# Altium project BATTERY-CHARGER-NOV2021.PrjPcb
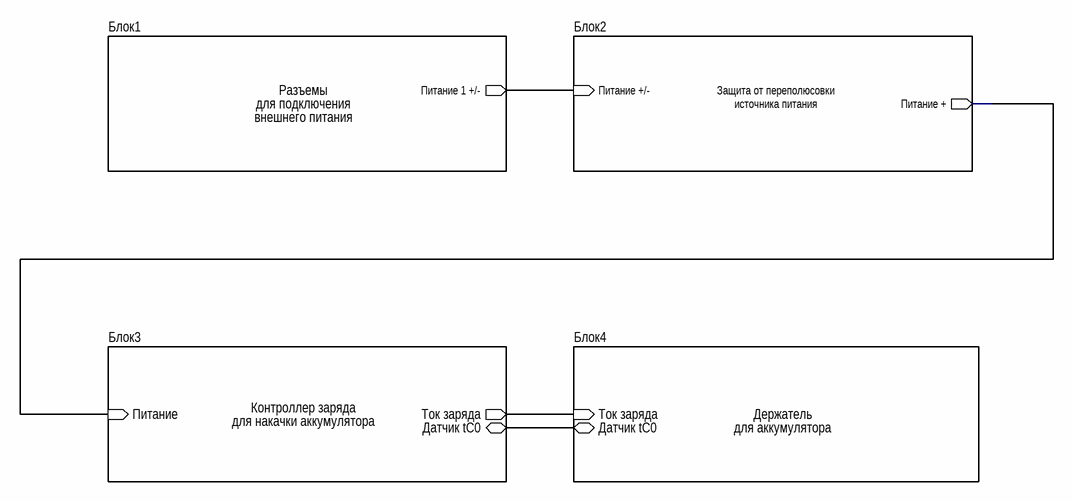
[diagram p0: Структура.SchDoc]
5 sheets, 27 parts. Net scope: flat (ports and power ports of the same name join across sheets).
Board file: PCB1.PcbDoc
Sheets:
  Структура.SchDoc
    Блок1 = Блок1.SchDoc
    Блок3 = Блок3.SchDoc
    Блок4 = Блок4.SchDoc
    Блок2 = Блок2.SchDoc

## Sheet Структура.SchDoc
size A4; SheetNumber: 1; SheetTotal: 3

### Sub-sheets
Блок1 = Блок1.SchDoc: Питание 1 +/- (out)  | Parameter 1: Разъемы; Parameter 2: для подключения; Parameter 3: внешнего питания
Блок2 = Блок2.SchDoc: Питание + (out), Питание +/- (in)  | Parameter 1: источника питания; Parameter 3: Защита от переполюсовки
Блок3 = Блок3.SchDoc: Питание (in), Ток заряда (out), Датчик tC0 (bidir)  | Parameter 1: Контроллер заряда; Parameter 2: для накачки аккумулятора; Parameter 3: для накачки аккумулятора
Блок4 = Блок4.SchDoc: Ток заряда (in), Датчик tC0 (bidir)  | Parameter 1: Держатель; Parameter 2: для аккумулятора; Parameter 3: -

### Nets
(unnamed): sheet Блок1/Питание 1 +/-, sheet Блок2/Питание +/-
(unnamed): sheet Блок3/Питание, sheet Блок2/Питание +
(unnamed): sheet Блок3/Ток заряда, sheet Блок4/Ток заряда
(unnamed): sheet Блок3/Датчик tC0, sheet Блок4/Датчик tC0

## Sheet Блок1.SchDoc
size A4; SheetNumber: 2; SheetTotal: 2
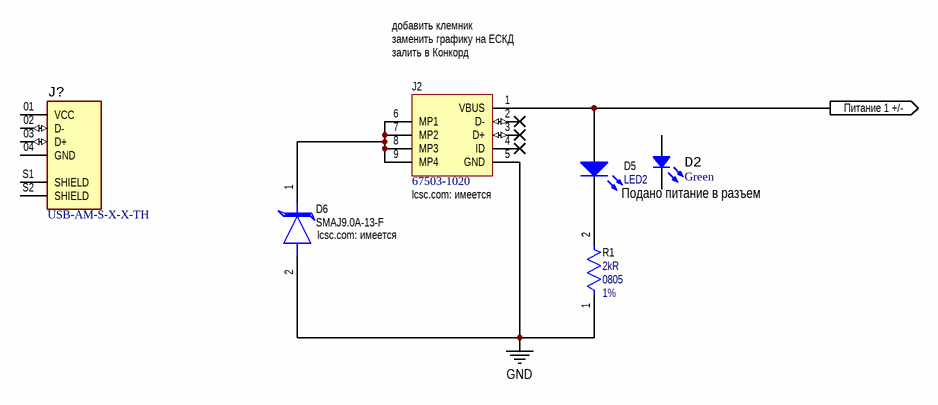
[diagram p1: Блок1.SchDoc]

### Parts
D2  Green  [LED 1206_3216 GREEN]
D5  LED2  Parameter 1: Подано питание в разъем  [3.2X1.6X1.1]
D6  SMAJ9.0A-13-F  lcsc.com: имеется  [FP-SMA-MFG]
J2  67503-1020  lcsc.com: имеется  [MOLX-67503-1020_V]
J?  USB-AM-S-X-X-TH  [SAMTEC_USB-AM-S-X-X-TH]
R1  Resistance: 2kR  Case/Package: 0805  Tolerance: 1%  [FP-MC01W0805-IPC_C]  (hidden comment: MC01W0805110K)

### Ports
Питание 1 +/- (out)

### Nets
GND: D6.2(A) J2.5(GND) R1.1
NetD5_1: D5.1(A) J2.1(VBUS) ; port Питание 1 +/-
NetD5_2: D5.2(K) R1.2
NetD6_1: D6.1(C) J2.6(MP1) J2.7(MP2) J2.8(MP3) J2.9(MP4)

Not connected (* = marked no-connect by the designer): D2 1 2; J2 2(D-)* 3(D+)* 4(ID)*; J? 01(VCC) 02(D-) 03(D+) 04(GND) S1(SHIELD) S2(SHIELD)

### Notes on the sheet
- добавить клемник
- заменить графику на ЕСКД
- (near J2) залить в Конкорд

### Library data of the parts
D2 = SML-LX1206SUGC-TR: LED GREEN CLEAR 1206 SMD; Manufacturer: Lumex Opto/Components Inc.; Configuration: Standard; Current - Test: 20mA; Lens Color: Colorless; Lens Size: 2.00mm x 1.50mm; Lens Style: Rectangle with Flat Top; Millicandela Rating: 45mcd; Viewing Angle: 140°; Voltage - Forward (Vf) (Typ): 2.2V; Wavelength - Peak: 574nm; Part Number: SML-LX1206SUGC-TR; Color: Green; ComponentLink1Description: Datasheet; ComponentLink1URL: https://www.lumex.com/content/files/ProductAttachment/SML-LX1206SUGC-TR.pdf; ComponentLink2Description: DigiKey Link; ComponentLink2URL: http://digikey.com/product-detail/en/lumex-opto-components-inc/SML-LX1206SUGC-TR/67-1698-1-ND/467582; Device Package: 1206 (3216 Metric); Height (Max): 1.10mm; LastUpdated: 02.09.2020 1:20:47; Lens Transparency: Clear; Lifecycle Status: Active; Minimum Order: 1; Mounting Type: Surface Mount; Package / Case: 1206 (3216 Metric); Packaging: TapeAndReel; PartId: 530; Part Status: Active; Price: 0.09; Series: -; Size / Dimension: 3.20mm L x 1.60mm W; Supplier 1: DigiKey; Supplier Part Number 1: 67-1698-1-ND; Supplier Device Package: 1206; Value: Green
D5 = LED2: Typical RED, GREEN, YELLOW, AMBER GaAs LED; Published: 8-Jun-2000; LatestRevisionDate: 17-Jul-2002; LatestRevisionNote: Re-released for DXP Platform.; PackageVersion: Feb-2002; PackageReference: 3.2X1.6X1.1; Publisher: Altium Limited; PackageDescription: SM LED; 2 Flat Leads
D6 = CMP-12828-000014-1: TVS DIODE 9V 15.4V SMA; Manufacturer: Diodes Inc; Number Of Channels: 1; Standoff Height: 0.05mm; Max Junction Temp: +150°C; Direction: Unidirectional; Breakdown Voltage: 10V; Peak Pulse Current: 26A; Peak Pulse Power: 400W; Category: Diode; Footprint Url: https://www.diodes.com/assets/Package-Files/SMA.pdf; Lead Free: Yes; Mouser Description: TVS Diodes - Transient Voltage Suppressors 400W 9.0V; Automotive: No; Temperature Range Low: -55°C; Temperature Range High: +150°C; Manufacturer Part Number: SMAJ9.0A-13-F; RoHS: TRUE; Octopart: https://octopart.com/smaj9.0a-13-f-diodes+inc.-350369; Device Class L3: unset; Device Class L2: TVS Diodes; Clamping Voltage: 15.4V; Temperature: -55°C to +150°C; ComponentLink2Description: Datasheet; Package: SMA; Reverse Standoff Voltage: 9V; Digikey Description: TVS DIODE 9V 15.4V SMA; Height: 2.4mm; ComponentLink2URL: https://www.diodes.com/assets/Datasheets/ds19005.pdf; Device Class L1: Circuit Protection; lcsc.com link: https://lcsc.com/product-detail/TVS_Diodes-Incorporated-SMAJ9-0CA-13-F_C135023.html
J2 = CMP-0411-00002-1: USB, MINI, SMD, RA KME04-USBMU03A01; Manufacturer: Molex; ComponentLink1URL: http://www.molex.com/; PartNumber: 67503-1020; Mounting Technology: Surface Mount; ComponentLink1Description: Manufacturer URL; Terminal Pitch: 0.8 mm; DatasheetVersion: Rev F, 06/2009; ComponentLink2Description: Datasheet; PackageDescription: Mini USB Connector, SMT, Righer Angle; ComponentLink2URL: http://www.molex.com/pdm_docs/sd/675031020_sd.pdf; PackageReference: 67503-1020; lcsc.com/product: https://lcsc.com/product-detail/USB-Connectors_MOLEX-675031020_C136451.html
J? = CMP-003-000000-2: USB-A (USB TYPE-A) USB 2.0 Plug Connector 4 Position Through Hole, Right Angle; MF: Samtec; MP: USB-AM-S-F-B-TH; SnapEDA_Link: https://www.snapeda.com/parts/USB-AM-S-F-B-TH/Samtec%20Inc./view-part/474273/?ref=snap; Price: None; Toby_UK-Purchase-URL: https://snapeda.com/shop?store=Toby+UK&id=474273; Value: *; Package: None; Component Type: Standard; Pin Count: 6; Availability: Unavailable; Design Item ID: USB-AM-S-X-X-TH; Source: SnapEDAsch.SchLib
R1 = CMP-12256-000003-1: Resistor, 10K, 0.1W, 1%, 0805, Reel; Manufacturer: Multicomp; Voltage Rating: 150V; Temperature Coefficient: 100ppm/°C; Power Rating: 100mW; REACH SVHC: No SVHC; Composition: Thick Film; Max Operating Temperature: 155°C; Number of Pins: 2; Case Code (Metric): 2012; Voltage Rating (DC): 150V; Min Operating Temperature: -55°C; Width: 1.25mm; Case Code (Imperial): 0805; Packaging: Cut Tape; Supplier 1: Newark; Supplier Part Number 1: 07W5303; Manufacturer Part Number: MC01W0805110K; RoHS: No; Category: Chip SMD Resistors; Stock 1: 940000; Pricing 1: 1=0,00900, 5000=0,00900, 10000=0,00800, 25000=0,00600 (USD); Series: MC; Resistor Type: Thick Film; Resistance Tolerance: 1%; RoHS Compliant: No; ComponentLink1URL: https://datasheet.ciiva.com/7881/1729047-7881334.pdf?src-supplier=Element14; ComponentLink1Description: https://datasheet.ciiva.com/7881/1729047-7881334.pdf?src-supplier=Element14; ComponentLink2URL: https://datasheet.ciiva.com/7881/1729047-7881333.pdf?src-supplier=Element14; ComponentLink2Description: https://datasheet.ciiva.com/7881/1729047-7881333.pdf?src-supplier=Element14

## Sheet Блок3.SchDoc
size A4
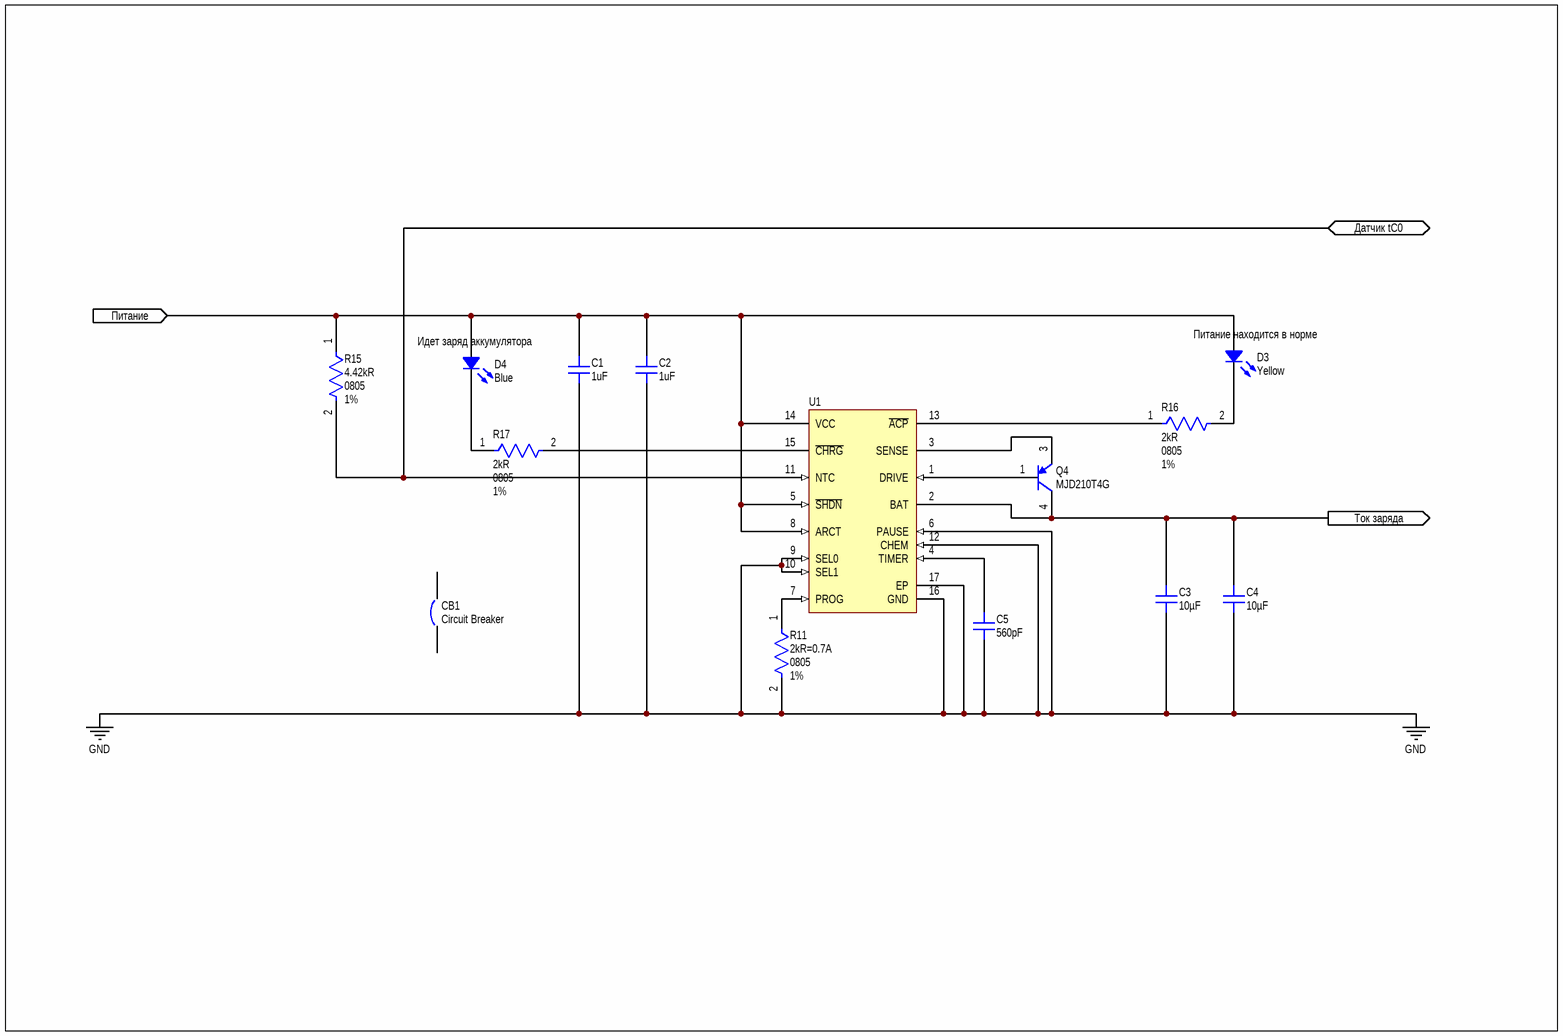
[diagram p2: Блок3.SchDoc]

### Parts
C1  1uF  [CAP 1206_3216 - 1.2MM]
C2  1uF  [CAP 1206_3216 - 1.2MM]
C3  10µF  [CAP 1206_3216 - 1.0MM]
C4  10µF  [CAP 1206_3216 - 1.0MM]
C5  560pF  [CAP 1206_3216 - 0.8MM]
CB1  Circuit Breaker  [SPST-2]
D3  Yellow  Parameter 1: Питание находится в норме  [LED 1206_3216 YELLOW]
D4  Blue  Parameter 1: Идет заряд аккумулятора  [LED 1206_3216 BLUE]
Q4  MJD210T4G  [ONSC-DPAK-3-369C-01_V]
R11  Resistance: 2kR=0.7A  Case/Package: 0805  Tolerance: 1%  [FP-MC01W0805-IPC_C]  (hidden comment: MC01W0805110K)
R15  Resistance: 4.42kR  Case/Package: 0805  Tolerance: 1%  [FP-MC01W0805-IPC_C]  (hidden comment: MC01W0805110K)
R16  Resistance: 2kR  Case/Package: 0805  Tolerance: 1%  [FP-MC01W0805-IPC_C]  (hidden comment: MC01W0805110K)
R17  Resistance: 2kR  Case/Package: 0805  Tolerance: 1%  [FP-MC01W0805-IPC_C]  (hidden comment: MC01W0805110K)
U1  LTC4060EDHC#PBF  [LT-DHC-16_V]  (value not drawn)

### Ports
Датчик tC0 (bidir), Питание (in), Ток заряда (out)

### Nets
GND: C1.1 C2.1 C3.1 C4.1 C5.1 R11.2 U1.6(PAUSE) U1.9(SEL0) U1.10(SEL1) U1.12(CHEM) U1.16(GND) U1.17(EP)
NetBH1_1: C3.2 C4.2 Q4.4(C) U1.2(BAT) ; port Ток заряда
NetC1_2: C1.2 C2.2 D3.1 D4.1 R15.1 U1.5(~{SHDN}) U1.8(ARCT) U1.14(VCC) ; port Питание
NetC5_2: C5.2 U1.4(TIMER)
NetD3_2: D3.2 R16.2
NetD4_2: D4.2 R17.1
NetQ4_1: Q4.1(B) U1.1(DRIVE)
NetQ4_3: Q4.3(E) U1.3(SENSE)
NetR11_1: R11.1 U1.7(PROG)
NetR15_2: R15.2 U1.11(NTC) ; port Датчик tC0
NetR16_1: R16.1 U1.13(~{ACP})
NetR17_2: R17.2 U1.15(~{CHRG})

Not connected (* = marked no-connect by the designer): CB1 1 2

### Library data of the parts
C1 C2 = C1206C105M5RACTU: CAP CER 1UF 50V X7R 1206; Manufacturer: KEMET; Capacitance: 1µF; Tolerance: ±20%; Part Number: C1206C105M5RACTU; Value: 1uF; Applications: Bypass, Decoupling; ComponentLink1Description: Datasheet; ComponentLink1URL: https://api.kemet.com/component-edge/download/datasheet/C1206C105M5RACTU.pdf; ComponentLink2Description: DigiKey Link; ComponentLink2URL: http://digikey.com/product-detail/en/kemet/C1206C105M5RACTU/399-8151-1-ND/3471874; Device Package: 1206 (3216 Metric); LastUpdated: 02.09.2020 1:05:10; Lifecycle Status: Active; Minimum Order: 1; Mounting Type: Surface Mount, MLCC; Operating Temperature: -55°C ~ 125°C; Package / Case: 1206 (3216 Metric); Packaging: TapeAndReel; PartId: 18886; Part Status: Active; Price: 0.07; Series: SMD Comm X7R; Size / Dimension: 0.126" L x 0.063" W (3.20mm x 1.60mm); Supplier 1: DigiKey; Supplier Part Number 1: 399-8151-1-ND; Temperature Coefficient: X7R; Thickness (Max): 0.043" (1.10mm); Voltage - Rated: 50V
C3 C4 = EMK316BJ106MD-T: CAP CER 10UF 16V X5R 1206; Manufacturer: Taiyo Yuden; Tolerance: ±20%; Part Number: EMK316BJ106MD-T; Value: 10µF; Applications: General Purpose; Capacitance: 10µF; ComponentLink1Description: Datasheet; ComponentLink1URL: http://www.yuden.co.jp/productdata/catalog/mlcc06_e.pdf; ComponentLink2Description: DigiKey Link; ComponentLink2URL: http://digikey.com/product-detail/en/taiyo-yuden/EMK316BJ106MD-T/587-4881-1-ND/6563724; Device Package: 1206 (3216 Metric); LastUpdated: 02.09.2020 1:05:06; Lifecycle Status: Active; Minimum Order: 1; Mounting Type: Surface Mount, MLCC; Operating Temperature: -55°C ~ 85°C; Package / Case: 1206 (3216 Metric); Packaging: TapeAndReel; PartId: 18996; Part Status: Active; Price: 0.05; Series: M; Size / Dimension: 0.126" L x 0.063" W (3.20mm x 1.60mm); Supplier 1: DigiKey; Supplier Part Number 1: 587-4881-1-ND; Temperature Coefficient: X5R; Thickness (Max): 0.037" (0.95mm); Voltage - Rated: 16V
C5 = CC1206JRNPO9BN561: CAP CER 560PF 50V NPO 1206; Manufacturer: Yageo; Temperature Coefficient: C0G, NP0; Tolerance: ±5%; Part Number: CC1206JRNPO9BN561; Value: 560pF; Applications: General Purpose; Capacitance: 560pF; ComponentLink1Description: Datasheet; ComponentLink1URL: https://www.yageo.com/upload/media/product/productsearch/datasheet/mlcc/UPY-GP_NP0_16V-to-50V_17.pdf; ComponentLink2Description: DigiKey Link; ComponentLink2URL: http://digikey.com/product-detail/en/yageo/CC1206JRNPO9BN561/311-4422-1-ND/8025511; Device Package: 1206 (3216 Metric); LastUpdated: 02.09.2020 1:04:45; Lifecycle Status: Active; Minimum Order: 1; Mounting Type: Surface Mount, MLCC; Operating Temperature: -55°C ~ 125°C; Package / Case: 1206 (3216 Metric); Packaging: TapeAndReel; PartId: 18850; Part Status: Active; Price: 0.05; Series: CC; Size / Dimension: 0.126" L x 0.063" W (3.20mm x 1.60mm); Supplier 1: DigiKey; Supplier Part Number 1: 311-4422-1-ND; Thickness (Max): 0.028" (0.70mm); Voltage - Rated: 50V
D3 = APTD3216SYCK: LED YELLOW CLEAR 2SMD; Manufacturer: Kingbright; Configuration: Standard; Current - Test: 20mA; Lens Color: Colorless; Lens Size: 1.60mm Dia; Lens Style: Round with Domed Top; Millicandela Rating: 800mcd; Viewing Angle: 35°; Voltage - Forward (Vf) (Typ): 2V; Wavelength - Dominant: 590nm; Part Number: APTD3216SYCK; Color: Yellow; ComponentLink1Description: Datasheet; ComponentLink1URL: http://www.kingbrightusa.com/images/catalog/SPEC/APTD3216SYCK.pdf; ComponentLink2Description: DigiKey Link; ComponentLink2URL: http://digikey.com/product-detail/en/kingbright/APTD3216SYCK/754-1160-1-ND/1747877; Device Package: 1206 (3216 Metric); Height (Max): 1.90mm; LastUpdated: 02.09.2020 1:21:25; Lens Transparency: Clear; Lifecycle Status: Active; Minimum Order: 1; Mounting Type: Surface Mount; Package / Case: 1206 (3216 Metric); Packaging: TapeAndReel; PartId: 38; Part Status: Active; Price: 0.10; Series: -; Size / Dimension: 3.20mm L x 1.60mm W; Supplier 1: DigiKey; Supplier Part Number 1: 754-1160-1-ND; Supplier Device Package: 2-SMD; Value: Yellow; Wavelength - Peak: 590nm
D4 = IN-S126ATB: LED BLUE CLEAR 1206 SMD; Manufacturer: Inolux; Configuration: Standard; Current - Test: 20mA; Lens Size: 2.00mm x 1.50mm; Lens Style: Rectangle with Flat Top; Millicandela Rating: 140mcd; Viewing Angle: 120°; Voltage - Forward (Vf) (Typ): 3.2V; Wavelength - Dominant: 468nm; Wavelength - Peak: 472nm; Part Number: IN-S126ATB; Color: Blue; ComponentLink1Description: Datasheet; ComponentLink1URL: http://www.inolux-corp.com/datasheet/SMDLED/Mono%20Color%20Top%20View/IN-S126AT%20Series_V1.0.pdf; ComponentLink2Description: DigiKey Link; ComponentLink2URL: http://digikey.com/product-detail/en/inolux/IN-S126ATB/1830-1088-1-ND/7604680; Device Package: 1206 (3216 Metric); Height (Max): 1.10mm; LastUpdated: 02.09.2020 1:20:34; Lens Color: Clear; Lens Transparency: Clear; Lifecycle Status: Active; Minimum Order: 1; Mounting Type: Surface Mount; Package / Case: 1206 (3216 Metric); Packaging: TapeAndReel; PartId: 723; Part Status: Active; Price: 0.07; Series: IN-S126AT; Size / Dimension: 3.20mm L x 1.50mm W; Supplier 1: DigiKey; Supplier Part Number 1: 1830-1088-1-ND; Supplier Device Package: 1206; Value: Blue
Q4 = CMP-1048-00154-1: Complementary Plastic Power Transistor, PNP Silicon, 3-Pin DPAK, Pb-Free, Tape and Reel; Manufacturer: On Semiconductor; fT Min (MHz): 65; IC Continuous (A): 5; ComponentLink1URL: http://www.onsemi.com/; Mounting Technology: Surface Mount; ComponentLink3Description: Package Specification; PackageReference: DPAK-3-369C-01; DatasheetVersion: Rev. 13; ComponentLink2URL: http://www.onsemi.cn/pub_link/Collateral/MJD200-D.PDF; ComponentLink3URL: http://www.onsemi.cn/pub_link/Collateral/369C.PDF; Packing: Tape and Reel; PackageDescription: 3-Pin Flange Mount, Body 6.54 x 6.095 mm, Pitch 2.29 mm; PartNumber: MJD210T4G; Polarity: PNP; RoHS: TRUE; PackageVersion: Rev. E, 02/2014; ComponentLink2Description: Datasheet; ComponentLink1Description: Manufacturer URL
R11 R15-R17 = CMP-12256-000003-1: as R1 on sheet Блок1; REACH SVHC: No SVHC; Composition: Thick Film; Max Operating Temperature: 155°C; Number of Pins: 2; Case Code (Metric): 2012; Voltage Rating (DC): 150V; Min Operating Temperature: -55°C; Width: 1.25mm; Case Code (Imperial): 0805; Packaging: Cut Tape; Supplier 1: Newark; Supplier Part Number 1: 07W5303; Manufacturer Part Number: MC01W0805110K; RoHS: No; Category: Chip SMD Resistors; Stock 1: 940000; Pricing 1: 1=0,00900, 5000=0,00900, 10000=0,00800, 25000=0,00600 (USD); Series: MC; Resistor Type: Thick Film; Resistance Tolerance: 1%; RoHS Compliant: No; ComponentLink1URL: https://datasheet.ciiva.com/7881/1729047-7881334.pdf?src-supplier=Element14; ComponentLink1Description: https://datasheet.ciiva.com/7881/1729047-7881334.pdf?src-supplier=Element14; ComponentLink2URL: https://datasheet.ciiva.com/7881/1729047-7881333.pdf?src-supplier=Element14; ComponentLink2Description: https://datasheet.ciiva.com/7881/1729047-7881333.pdf?src-supplier=Element14
U1 = CMP-0471-00160-1: Standalone Linear NiMH / NiCd Fast Battery Charger, 4.5 to 10 V Vin, 16-pin SON (DHC-16), -40 to 85 degC, Pb-Free; Manufacturer: Linear Technology; Float Voltage: Adj; Vin Min(V): 4.5; Max Charge Current(A): 2; Battery Chemistry: NiCd, NiMH, Lead Acid; Number of Cells: 1 to 4; Vin Max(V): 10; PartNumber: LTC4060EDHC#PBF; PackageVersion: Jun-10; ComponentLink1URL: http://www.linear.com/; ComponentLink3Description: Package Specification; RoHS: TRUE; PackageReference: DHC-16; ComponentLink2Description: Datasheet; Mounting Technology: Surface Mount; PackageDescription: 16-Pin Plastic DFN, Body 5 x 3 mm, Pitch 0.5 mm; ComponentLink1Description: Manufacturer URL; Type of Charger: Linear; ComponentLink2URL: http://cds.linear.com/docs/en/datasheet/4060f.pdf; ComponentLink3URL: http://cds.linear.com/docs/en/packaging/DFN_16_05-08-1706.pdf; Code_JEDEC: MO-229
CB1 = Circuit Breaker: Published: 24-Mar-1999; LatestRevisionDate: 17-Jul-2002; LatestRevisionNote: Re-released for DXP Platform.; PackageReference: SPST-2; Publisher: Altium Limited; PackageDescription: Switch; 2 Leads

## Sheet Блок4.SchDoc
size A4
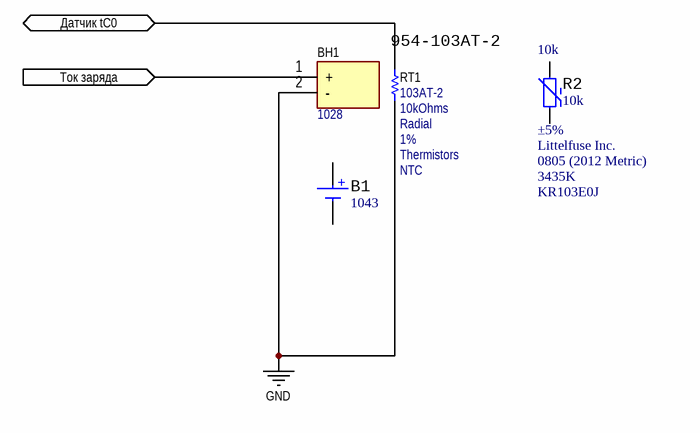
[diagram p3: Блок4.SchDoc]

### Parts
B1  1043  [KEYSTONE 1043]
BH1  1028  [1028]
R2  10k  Part Number: KR103E0J  B25/85: 3435K  Manufacturer: Littelfuse Inc.  Package / Case: 0805 (2012 Metric)  Resistance Tolerance: ±5%  [NTC 0805_2012]
RT1  103AT-2  Resistance: 10kOhms  Termination Style: Radial  Tolerance: 1%  Product Category: Thermistors  Type: NTC  Supplier Part Number 1: 954-103AT-2  [SEMI-103AT-2_V]

### Ports
Датчик tC0 (bidir), Ток заряда (in)

### Nets
GND: BH1.2(-) RT1.1
NetBH1_1: BH1.1(+) ; port Ток заряда
NetR15_2: RT1.2 ; port Датчик tC0

Not connected (* = marked no-connect by the designer): B1 1(+) 2(-); R2 1 2

### Library data of the parts
B1 = 1043: BATTERY HOLDER 18650 PC PIN; Manufacturer: Keystone Electronics; Battery Cell Size: 18650; Battery Type, Function: Cylindrical, Holder; Number of Cells: 1; Style: Holder (Open); Part Number: 1043; ComponentLink1Description: Datasheet; ComponentLink1URL: http://keyelco.com/userAssets/file/M65p27.pdf; ComponentLink2Description: DigiKey Link; ComponentLink2URL: http://digikey.com/product-detail/en/keystone-electronics/1043/36-1043-ND/2745669; Height Above Board: 0.585" (14.86mm); LastUpdated: 02.02.2020 9:19:56; Lifecycle Status: Active; Minimum Order: 1; Mounting Type: PCB, Through Hole; Operating Temperature: -50°C ~ 145°C; Packaging: Unknown; PartId: 2; Part Status: Active; Price: 2.58; Series: -; Supplier 1: DigiKey; Supplier Part Number 1: 36-1043-ND; Termination Style: PC Pin
BH1 = 1028: Undefined or Miscellaneous; Manufacturer_Name: Keystone Electronics; Datasheet Link: http://www.keyelco.com/product-pdf.cfm?p=929; Height: 15.49mm; Manufacturer_Part_Number: 1028; Mouser Part Number: 534-1028; Mouser Price/Stock: https://www.mouser.co.uk/ProductDetail/Keystone-Electronics/1028?qs=TMDrOSIpnUdoTBwO9TubhA%3D%3D; Arrow Part Number: 1028; Arrow Price/Stock: https://www.arrow.com/en/products/1028/keystone-electronics
R2 = KR103E0J: THERMISTOR NTC 10KOHM 3435K 0805; Power - Max: 300mW; ComponentLink1Description: Datasheet; ComponentLink1URL: https://www.littelfuse.com/~/media/electronics/datasheets/surface_mount_thermistors/littelfuse_surface_mount_thermistors_end_banded_chip_thermistors_0805_kr_datasheet.pdf.pdf; ComponentLink2Description: DigiKey Link; ComponentLink2URL: http://digikey.com/product-detail/en/littelfuse-inc/KR103E0J/KR103E0J-ND/4923947; LastUpdated: 30.08.2020 21:02:56; Lifecycle Status: Active; Minimum Order: 500; Mounting Type: Surface Mount; Packaging: Bulk; PartId: 1290; Price: 0.48; Resistance in Ohms @ 25°C: 10k; Series: KR; Supplier 1: DigiKey; Supplier Part Number 1: KR103E0J-ND; Value: 10k
RT1 = CMP-2000-05824-1: Precision NTC Thermistor, 10 kOhm, +/- 1%, 10 mW, -50 to 110 degC, 2-Pin THD, RoHS, Bulk; Brand: Semitec; Packaging: Bulk; Mounting Technology: ThroughHole; Operating Temperature Range: -50Cto+110C; Lead Spacing: 2.54mm; RoHS: True; Manufacturer URL: http://www.semitec.co.jp/english/; Datasheet Version: Rev. A, 02/2007; Length: 17mm; Manufacturer: Semitec; Datasheet URL: https://www.rapidonline.com/pdf/61-0500e.pdf; Series: AT; Package Description: 2-Pin Through Hole Device, Body Width 3.8 mm (Max), Pitch 2.54 mm; Width: 3.7mm; Package Reference: 103AT-2; Height: 2.4mm; Supplier 1: Mouser; Manufacturer Part Number: 103AT-2; Category: Thermistors; Stock 1: 13690; Pricing 1: 1=2,25000, 10=2,06000, 50=2,06000, 100=1,67000, 200=0,75000, 600=0,66000, 1000=0,42000, 2000=0,35400, 5000=0,34500, 10000=0,33500 (USD); Number of Pins: 2; Min Operating Temperature: -50°C; Max Operating Temperature: 110°C; Termination: Radial; Lead Pitch: 2.54mm; RoHS Compliant: Yes; ComponentLink1URL: https://datasheet.ciiva.com/4505/semitec-atthermistor-371460-4505142.pdf?src-supplier=Mouser; ComponentLink1Description: https://datasheet.ciiva.com/4505/semitec-atthermistor-371460-4505142.pdf?src-supplier=Mouser; ComponentLink2URL: https://datasheet.ciiva.com/26346/61-0500e-26346397.pdf?src-supplier=Rapid+Electronics; ComponentLink2Description: https://datasheet.ciiva.com/26346/61-0500e-26346397.pdf?src-supplier=Rapid+Electronics

## Sheet Блок2.SchDoc
size A4
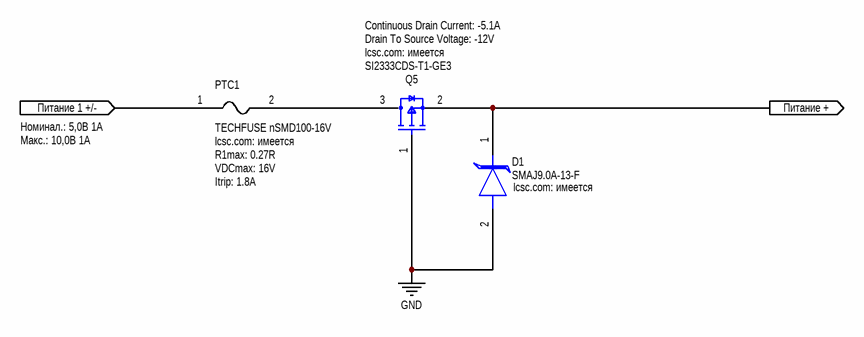
[diagram p4: Блок2.SchDoc]

### Parts
D1  SMAJ9.0A-13-F  lcsc.com: имеется  [FP-SMA-MFG]
PTC1  TECHFUSE nSMD100-16V  lcsc.com: имеется  R1max: 0.27R  VDCmax: 16V  Itrip: 1.8A  [nSMD100-16V]
Q5  SI2333CDS-T1-GE3  Continuous Drain Current: -5.1A  Drain To Source Voltage: -12V  lcsc.com: имеется  [FP-S-03946-MFG]

### Ports
Питание 1 +/- (in), Питание + (out)

### Nets
GND: D1.2(A) Q5.1(G)
NetD1_1: D1.1(C) Q5.2(S) ; port Питание +
NetD5_1: PTC1.1 ; port Питание 1 +/-
NetPTC1_2: PTC1.2 Q5.3(D)

### Library data of the parts
D1 = CMP-12828-000014-1: as D6 on sheet Блок1; Category: Diode; Footprint Url: https://www.diodes.com/assets/Package-Files/SMA.pdf; Lead Free: Yes; Mouser Description: TVS Diodes - Transient Voltage Suppressors 400W 9.0V; Automotive: No; Temperature Range Low: -55°C; Temperature Range High: +150°C; Manufacturer Part Number: SMAJ9.0A-13-F; RoHS: TRUE; Octopart: https://octopart.com/smaj9.0a-13-f-diodes+inc.-350369; Device Class L3: unset; Device Class L2: TVS Diodes; Clamping Voltage: 15.4V; Temperature: -55°C to +150°C; ComponentLink2Description: Datasheet; Package: SMA; Reverse Standoff Voltage: 9V; Digikey Description: TVS DIODE 9V 15.4V SMA; Height: 2.4mm; ComponentLink2URL: https://www.diodes.com/assets/Datasheets/ds19005.pdf; Device Class L1: Circuit Protection; lcsc.com link: https://lcsc.com/product-detail/TVS_Diodes-Incorporated-SMAJ9-0CA-13-F_C135023.html
Q5 = CMP-02550-000209-1: MOSFET P-CH 12V 7.1A SOT-23; Manufacturer: Vishay; Gate To Source Voltage: 8V; Pulse Drain Current: -20A; Transconductance: 18.5S; Turn On Delay Time: 13ns; Turn Off Delay Time: 45ns; Max Forward Diode Voltage: -1.2V; Gate Charge At Vgs: 15nC @ -4.5V; Reverse Recovery Time: 32ns; Depletion Mode: False; Typ Forward Diode Voltage: -0.7V; Drain To Source Resistance: 0.0285Ω; Rthja Max: 75°C/W; Max Junction Temp: +150°C; Reverse Recovery Charge: 20nC; Number Of Channels: 1; Threshold Vgs Max: -1V; Standoff Height: 0.01mm; Input Capacitace At Vds: 1225pF @ -6V; Power Dissipation: 1.25W; Threshold Vgs Min: -0.4V; Temperature: -55°C to +150°C; Package: S-03946; Lead Free: Yes; Drain To Source Breakdown Voltage: -12V; Mouser Description: MOSFET 12V 5.1A 2.5W 35 mohms @ 4.5V; ComponentLink2Description: Datasheet; Automotive: No; Ipc Land Pattern Name: SOT95P237X100-3; ComponentLink2URL: http://www.vishay.com/docs/68717/si2333cd.pdf; Octopart: https://octopart.com/si2333cds-t1-ge3-vishay-43171447; Temperature Range High: +150°C; Digikey Description: MOSFET P-CH 12V 7.1A SOT-23; Category: Trans; Device Class L2: Transistors; Manufacturer Part Number: SI2333CDS-T1-GE3; RoHS: TRUE; Device Class L3: MOSFETs; Height: 1.12mm; Number Of P Channels: 1; Temperature Range Low: -55°C; Device Class L1: Discrete Semiconductors; lcsc.com link: https://lcsc.com/product-detail/MOSFETs_Vishay-Intertech-SI2333CDS-T1-GE3_C48179.html
PTC1 = TECHFUSE nSMD100-16V: Parameter 1: https://lcsc.com/product-detail/Resettable-Fuses_TECHFUSE-nSMD100-16V_C70082.html

## Nets that join several sheets
GND: Блок1 (D6.2 J2.5 R1.1), Блок3 (12 pins), Блок4 (BH1.2 RT1.1), Блок2 (D1.2 Q5.1)
NetBH1_1: Блок3 (C3.2 C4.2 Q4.4 U1.2), Блок4 (BH1.1)
NetD5_1: Блок1 (D5.1 J2.1), Блок2 (PTC1.1)
NetR15_2: Блок3 (R15.2 U1.11), Блок4 (RT1.2)